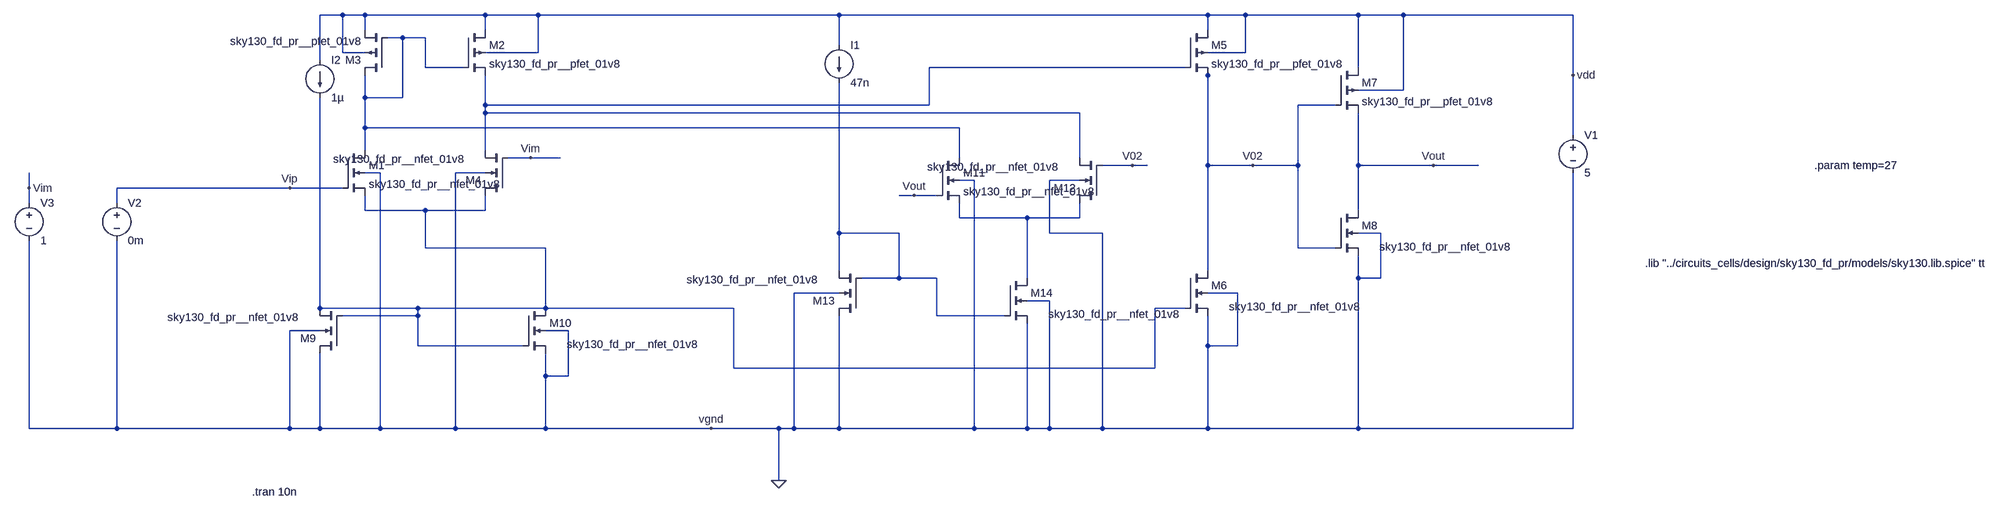
[diagram p0: schematic comparator_prog_hyst_internship.asc]
comparator_prog_hyst_internship.asc, the LTspice schematic file:
Version 4
SHEET 1 4496 1320
WIRE -48 224 -96 224
WIRE 0 224 -48 224
WIRE 256 224 0 224
WIRE 368 224 256 224
WIRE 1008 224 368 224
WIRE 1792 224 1008 224
WIRE 1872 224 1792 224
WIRE 2112 224 1872 224
WIRE 2208 224 2112 224
WIRE 2784 224 2208 224
WIRE 0 256 0 224
WIRE 256 256 256 224
WIRE 1792 256 1792 224
WIRE 80 272 48 272
WIRE 128 272 80 272
WIRE 1008 288 1008 224
WIRE -48 304 -48 224
WIRE 0 304 -48 304
WIRE 368 304 368 224
WIRE 368 304 256 304
WIRE 1872 304 1872 224
WIRE 1872 304 1792 304
WIRE -96 320 -96 224
WIRE 128 336 128 272
WIRE 208 336 128 336
WIRE 1744 336 1200 336
WIRE 2112 336 2112 224
WIRE 1792 352 1792 336
WIRE 2784 352 2784 224
WIRE 2208 384 2208 224
WIRE 2208 384 2112 384
WIRE 0 400 0 352
WIRE 80 400 80 272
WIRE 80 400 0 400
WIRE 256 416 256 352
WIRE 1200 416 1200 336
WIRE 1200 416 256 416
WIRE 2064 416 1984 416
WIRE 256 432 256 416
WIRE 1520 432 256 432
WIRE 0 464 0 400
WIRE 1264 464 0 464
WIRE 2784 480 2784 352
WIRE 0 512 0 464
WIRE 256 512 256 432
WIRE 352 528 304 528
WIRE 416 528 352 528
WIRE 1264 528 1264 464
WIRE 1520 528 1520 432
WIRE 1632 544 1568 544
WIRE 1664 544 1632 544
WIRE 1792 544 1792 352
WIRE 1888 544 1792 544
WIRE 1984 544 1984 416
WIRE 1984 544 1888 544
WIRE 2112 544 2112 432
WIRE 2272 544 2112 544
WIRE 2368 544 2272 544
WIRE 32 560 0 560
WIRE 256 560 192 560
WIRE 1296 576 1264 576
WIRE 1520 576 1456 576
WIRE -816 592 -816 560
WIRE -160 592 -528 592
WIRE -48 592 -160 592
WIRE 1168 608 1136 608
WIRE 1216 608 1168 608
WIRE -816 624 -816 592
WIRE -528 624 -528 592
WIRE 0 640 0 608
WIRE 128 640 0 640
WIRE 256 640 256 608
WIRE 256 640 128 640
WIRE 2112 640 2112 544
WIRE 1264 656 1264 624
WIRE 1408 656 1264 656
WIRE 1520 656 1520 624
WIRE 1520 656 1408 656
WIRE 1008 688 1008 368
WIRE 1136 688 1008 688
WIRE 1456 688 1456 576
WIRE 1568 688 1456 688
WIRE 2160 688 2112 688
WIRE 128 720 128 640
WIRE 384 720 128 720
WIRE 1984 720 1984 544
WIRE 2064 720 1984 720
WIRE 1008 768 1008 688
WIRE 1792 768 1792 544
WIRE 1136 784 1136 688
WIRE 1136 784 1056 784
WIRE 1216 784 1136 784
WIRE 1408 784 1408 656
WIRE 2112 784 2112 736
WIRE 2160 784 2160 688
WIRE 2160 784 2112 784
WIRE 1008 816 912 816
WIRE 1856 816 1792 816
WIRE 1456 832 1408 832
WIRE -96 848 -96 400
WIRE 112 848 -96 848
WIRE 384 848 384 720
WIRE 384 848 112 848
WIRE 784 848 384 848
WIRE 1744 848 1680 848
WIRE 112 864 112 848
WIRE 112 864 -48 864
WIRE 1216 864 1216 784
WIRE 1360 864 1216 864
WIRE -96 896 -160 896
WIRE 432 896 384 896
WIRE 112 928 112 864
WIRE 336 928 112 928
WIRE 1792 928 1792 864
WIRE 1856 928 1856 816
WIRE 1856 928 1792 928
WIRE 784 976 784 848
WIRE 1680 976 1680 848
WIRE 1680 976 784 976
WIRE 384 992 384 944
WIRE 432 992 432 896
WIRE 432 992 384 992
WIRE -816 1104 -816 704
WIRE -528 1104 -528 704
WIRE -528 1104 -816 1104
WIRE -160 1104 -160 896
WIRE -160 1104 -528 1104
WIRE -96 1104 -96 944
WIRE -96 1104 -160 1104
WIRE 32 1104 32 560
WIRE 32 1104 -96 1104
WIRE 192 1104 192 560
WIRE 192 1104 32 1104
WIRE 384 1104 384 992
WIRE 384 1104 192 1104
WIRE 736 1104 384 1104
WIRE 880 1104 736 1104
WIRE 912 1104 912 816
WIRE 912 1104 880 1104
WIRE 1008 1104 1008 864
WIRE 1008 1104 912 1104
WIRE 1296 1104 1296 576
WIRE 1296 1104 1008 1104
WIRE 1408 1104 1408 880
WIRE 1408 1104 1296 1104
WIRE 1456 1104 1456 832
WIRE 1456 1104 1408 1104
WIRE 1568 1104 1568 688
WIRE 1568 1104 1456 1104
WIRE 1792 1104 1792 928
WIRE 1792 1104 1568 1104
WIRE 2112 1104 2112 784
WIRE 2112 1104 1792 1104
WIRE 2784 1104 2784 560
WIRE 2784 1104 2112 1104
WIRE 880 1280 880 1104
FLAG -160 592 Vip
FLAG 352 528 Vim
FLAG 1168 608 Vout
FLAG 1632 544 V02
FLAG 1888 544 V02
FLAG 2272 544 Vout
FLAG 880 1280 0
FLAG 736 1104 vgnd
FLAG -816 592 Vim
FLAG 2784 352 vdd
SYMBOL nmos4 -48 512 R0
SYMATTR InstName M1
SYMATTR Value sky130_fd_pr__nfet_01v8
SYMBOL pmos4 208 256 R0
SYMATTR InstName M2
SYMATTR Value sky130_fd_pr__pfet_01v8
SYMBOL pmos4 48 352 R180
SYMATTR InstName M3
SYMATTR Value sky130_fd_pr__pfet_01v8
SYMBOL nmos4 304 608 R180
WINDOW 3 93 77 Left 2
SYMATTR Value sky130_fd_pr__nfet_01v8
SYMATTR InstName M4
SYMBOL pmos4 1744 256 R0
SYMATTR InstName M5
SYMATTR Value sky130_fd_pr__pfet_01v8
SYMBOL nmos4 1744 768 R0
WINDOW 3 93 77 Left 2
SYMATTR Value sky130_fd_pr__nfet_01v8
SYMATTR InstName M6
SYMBOL pmos4 2064 336 R0
SYMATTR InstName M7
SYMATTR Value sky130_fd_pr__pfet_01v8
SYMBOL nmos4 2064 640 R0
WINDOW 3 93 77 Left 2
SYMATTR Value sky130_fd_pr__nfet_01v8
SYMATTR InstName M8
SYMBOL nmos4 -48 944 R180
WINDOW 3 93 77 Left 2
SYMATTR Value sky130_fd_pr__nfet_01v8
SYMATTR InstName M9
SYMBOL nmos4 336 848 R0
WINDOW 3 93 77 Left 2
SYMATTR Value sky130_fd_pr__nfet_01v8
SYMATTR InstName M10
SYMBOL nmos4 1216 528 R0
SYMATTR InstName M11
SYMATTR Value sky130_fd_pr__nfet_01v8
SYMBOL nmos4 1568 624 R180
WINDOW 3 93 77 Left 2
SYMATTR Value sky130_fd_pr__nfet_01v8
SYMATTR InstName M12
SYMBOL nmos4 1056 864 R180
WINDOW 3 93 77 Left 2
SYMATTR Value sky130_fd_pr__nfet_01v8
SYMATTR InstName M13
SYMBOL nmos4 1360 784 R0
WINDOW 3 93 77 Left 2
SYMATTR Value sky130_fd_pr__nfet_01v8
SYMATTR InstName M14
SYMBOL current 1008 288 R0
WINDOW 123 0 0 Left 2
WINDOW 39 0 0 Left 2
SYMATTR InstName I1
SYMATTR Value 47n
SYMBOL current -96 320 R0
WINDOW 123 0 0 Left 2
WINDOW 39 0 0 Left 2
SYMATTR InstName I2
SYMATTR Value 1µ
SYMBOL voltage 2784 464 R0
WINDOW 123 0 0 Left 2
WINDOW 39 0 0 Left 2
SYMATTR InstName V1
SYMATTR Value 5
SYMBOL voltage -528 608 R0
WINDOW 123 0 0 Left 2
WINDOW 39 0 0 Left 2
SYMATTR InstName V2
SYMATTR Value 0m
SYMBOL voltage -816 608 R0
WINDOW 123 0 0 Left 2
WINDOW 39 0 0 Left 2
SYMATTR InstName V3
SYMATTR Value 1
TEXT -240 1304 Left 2 !.tran 10n
TEXT 3072 752 Left 2 !.lib "../circuits_cells/design/sky130_fd_pr/models/sky130.lib.spice" tt
TEXT 3432 544 Left 2 !.param temp=27

The netlist it stands for:
* comparator_prog_hyst_internship.asc
M1 N001 Vip N003 0 sky130_fd_pr__nfet_01v8
M2 vdd N001 N002 vdd sky130_fd_pr__pfet_01v8
M3 N001 N001 vdd vdd sky130_fd_pr__pfet_01v8
M4 N003 Vim N002 0 sky130_fd_pr__nfet_01v8
M5 vdd N002 V02 vdd sky130_fd_pr__pfet_01v8
M6 V02 N003 0 0 sky130_fd_pr__nfet_01v8
M7 vdd V02 Vout vdd sky130_fd_pr__pfet_01v8
M8 Vout V02 0 0 sky130_fd_pr__nfet_01v8
M9 0 N003 N003 0 sky130_fd_pr__nfet_01v8
M10 N003 N003 0 0 sky130_fd_pr__nfet_01v8
M11 N001 Vout N004 0 sky130_fd_pr__nfet_01v8
M12 N004 V02 N002 0 sky130_fd_pr__nfet_01v8
M13 0 N005 N005 0 sky130_fd_pr__nfet_01v8
M14 N004 N005 0 0 sky130_fd_pr__nfet_01v8
I1 vdd N005 47n
I2 vdd N003 1µ
V1 vdd 0 5
V2 Vip 0 0m
V3 Vim 0 1
.model NMOS NMOS
.model PMOS PMOS
.lib standard.mos
.tran 10n
.lib "../circuits_cells/design/sky130_fd_pr/models/sky130.lib.spice" tt
.param temp=27
.backanno
.end